# EAGLE design vinciDuino (EAGLE 6.2)
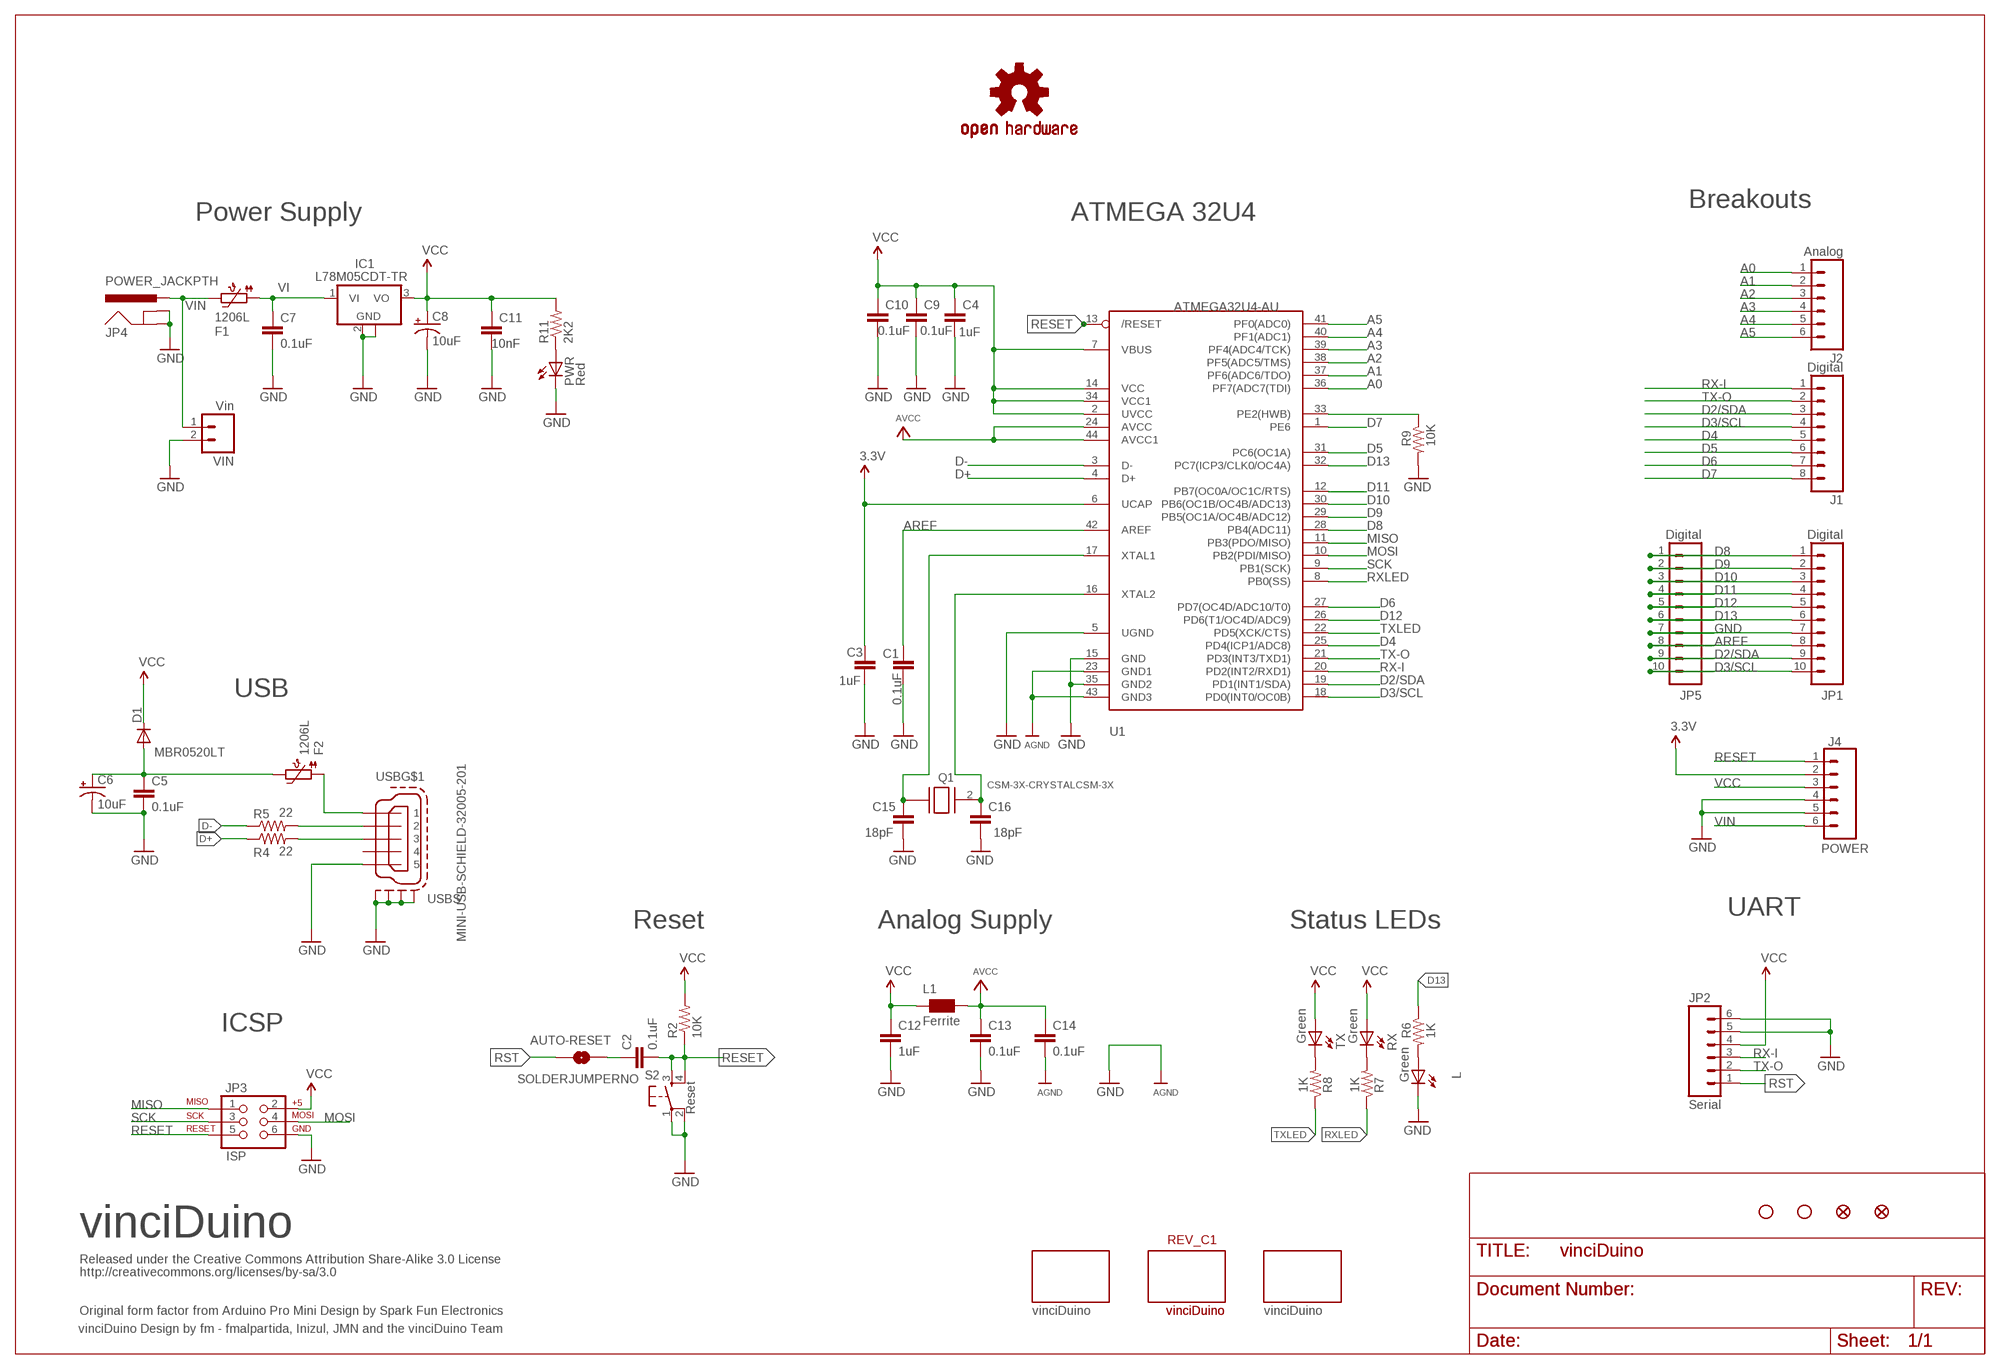
[diagram p0: schematic, sheet 1]

## Parts
AUTO-RESET  SOLDERJUMPERNO  [SJ_2S-NO]
C1  0.1uF  CAP1206  [1206]
C2  0.1uF  CAP1206  [1206]
C3  1uF  CAP1206  [1206]
C4  1uF  CAP1206  [1206]
C5  0.1uF  CAP1206  [1206]
C6  10uF  CAP_POL1206  [EIA3216]
C7  0.1uF  CAP1206  [1206]
C8  10uF  CAP_POL1206  [EIA3216]
C9  0.1uF  CAP1206  [1206]
C10  0.1uF  CAP1206  [1206]
C11  10nF  CAP1206  [1206]
C12  1uF  CAP1206  [1206]
C13  0.1uF  CAP1206  [1206]
C14  0.1uF  CAP1206  [1206]
C15  18pF  CAP1206  [1206]
C16  18pF  CAP1206  [1206]
D1  MBR0520LT  [SOD123]
F1  1206L  PTC1206_L  [1206_PTC]
F2  1206L  PTC1206_L  [1206_PTC]
IC1  L78M05CDT-TR  78XX  [SOT-223-DPAK]
J1  Digital  M081X08  [1X08]
J2  Analog  M06SIP  [1X06]
J4  POWER  M06SIP  [1X06]
JP1  Digital  M10"  [1X10]
JP2  Serial  M06SIP  [1X06]
JP3  ISP  AVR_SPI_PRG_6PTH  [2X3]
JP4  POWER_JACKPTH  [POWER_JACK_PTH]
JP5  Digital  M10"  [1X10]
L  Green  LED1206  [LED-1206]
L1  Ferrite  WE-CBF_1206W  [1206W]
PWR  Red  LED1206  [LED-1206]
Q1  CSM-3X-CRYSTALCSM-3X  [CSM-3X]
R2  10K  R-US_R1206  [R1206]
R4  22  R-US_R1206  [R1206]
R5  22  R-US_R1206  [R1206]
R6  1K  R-US_R1206  [R1206]
R7  1K  R-US_R1206  [R1206]
R8  1K  R-US_R1206  [R1206]
R9  10K  R-US_R1206  [R1206]
R11  2K2  R-US_R1206  [R1206]
REV_C1  vinciDuino  BOARD_INFO_  [ARDUINO_FORUM]
RX  Green  LED1206  [LED-1206]
S2  Reset  TAC_SWITCHSMD  [TACTILE_SWITCH_SMD]
TX  Green  LED1206  [LED-1206]
U1  ATMEGA32U4-AU  [TQFP44]
U$1  VINCIDUINO_  VINCIDUINO_25  [VINCIDUINO]
U$2  FIDUCIAL1X2  [FIDUCIAL-1X2]
U$3  VINCIDUINO_15  [VINCIDUINO_VSMAL]
U$4  FIDUCIAL1X2  [FIDUCIAL-1X2]
U$9  STAND-OFF  [STAND-OFF]
U$10  STAND-OFF  [STAND-OFF]
U$14  OSHW-LOGOS  [OSHW-LOGO-S]
USB  MINI-USB-SCHIELD-32005-201  [32005-201]
VIN  Vin  M021X02_NO_SILK  [1X02_NO_SILK]

## Nets
3.3V: C3.1 J4.2 U1.6(UCAP)
A0: J2.1 U1.36(PF7(ADC7(TDI))
A1: J2.2 U1.37(PF6(ADC6/TDO))
A2: J2.3 U1.38(PF5(ADC5/TMS))
A3: J2.4 U1.39(PF4(ADC4/TCK))
A4: J2.5 U1.40(PF1(ADC1))
A5: J2.6 U1.41(PF0(ADC0))
AREF: C1.2 JP1.8 JP5.8 U1.42(AREF)
AVCC: C13.1 C14.1 L1.2 U1.24(AVCC) U1.44(AVCC1)
D2/SDA: J1.3 JP1.9 JP5.9 U1.19(PD1(INT1/SDA))
D3/SCL: J1.4 JP1.10 JP5.10 U1.18(PD0(INT0/OC0B))
D4: J1.5 U1.25(PD4(ICP1/ADC8))
D5: J1.6 U1.31(PC6(OC1A))
D6: J1.7 U1.27(PD7(OC4D/ADC10/T0))
D7: J1.8 U1.1(PE6)
D8: JP1.1 JP5.1 U1.28(PB4(ADC11))
D9: JP1.2 JP5.2 U1.29(PB5(OC1A/OC4B/ADC12))
D10: JP1.3 JP5.3 U1.30(PB6(OC1B/OC4B/ADC13))
D11: JP1.4 JP5.4 U1.12(PB7(OC0A/OC1C/RTS))
D12: JP1.5 JP5.5 U1.26(PD6(T1/OC4D/ADC9))
D13: JP1.6 JP5.6 R6.1 U1.32(PC7(ICP3/CLK0/OC4A))
D+: R4.1 U1.4(D+)
D-: R5.1 U1.3(D-)
GND: C1.1 C3.2 C4.2 C5.2 C6.C(-) C7.2 C8.C(-) C9.2 C10.2 C11.2 C12.2 C13.2 C14.2 C15.2 C16.2 IC1.2(GND) IC1.4(GND) J4.4 J4.5 JP1.7 JP2.5 JP2.6 JP3.6 JP4.GND JP4.GNDBREAK JP5.7 L.C PWR.C R9.2 S2.1 S2.2 U1.5(UGND) U1.15(GND) U1.23(GND1) U1.35(GND2) U1.43(GND3) USB.5 USB.M1(S:S1) USB.M2(S:S2) USB.M3(S:S3) USB.M4(S:S4) VIN.2 ; supply symbol labelled AGND
MISO: JP3.1 U1.11(PB3(PDO/MISO))
MOSI: JP3.4 U1.10(PB2(PDI/MISO))
N$1: R8.2 TX.C
N$2: R5.2 USB.2
N$3: C16.1 Q1.2 U1.16(XTAL2)
N$4: C15.1 Q1.1 U1.17(XTAL1)
N$5: R4.2 USB.3
N$6: R9.1 U1.33(PE2(HWB))
N$7: L.A R6.2
N$8: AUTO-RESET.2 C2.1
N$9: R7.2 RX.C
N$13: F2.1 USB.1
N$38: PWR.A R11.1
RESET: C2.2 J4.1 JP3.5 R2.1 S2.3 S2.4 U1.13(/RESET)
RST: AUTO-RESET.1 JP2.1
RX-I: J1.1 JP2.3 U1.20(PD2(INT2/RXD1))
RXLED: R7.1 U1.8(PB0(SS))
SCK: JP3.3 U1.9(PB1(SCK))
TX-O: J1.2 JP2.2 U1.21(PD3(INT3/TXD1))
TXLED: R8.1 U1.22(PD5(XCK/CTS))
VBUS: C5.1 C6.A(+) D1.A F2.2
VCC: C4.1 C8.A(+) C9.1 C10.1 C11.1 C12.1 D1.C IC1.3(VO) J4.3 JP2.4 JP3.2 L1.1 R2.2 R11.2 RX.A TX.A U1.2(UVCC) U1.7(VBUS) U1.14(VCC) U1.34(VCC1)
VI [vcc]: C7.1 F1.1 IC1.1(VI)
VIN [vcc]: F1.2 J4.6 JP4.PWR VIN.1
Unconnected: USB.4

## Notes on the sheet
- Breakouts
- Power Supply | ATMEGA 32U4
- USB
- UART
- Reset | Analog Supply | Status LEDs
- ICSP
- vinciDuino
- Released under the Creative Commons Attribution Share-Alike 3.0 License
- http://creativecommons.org/licenses/by-sa/3.0
- Original form factor from Arduino Pro Mini Design by Spark Fun Electronics
- vinciDuino Design by fm - fmalpartida, Inizul, JMN and the vinciDuino Team

## Library data of the parts
AUTO-RESET = SparkFun:SOLDERJUMPER: Solder Jumper Standard SMD solder jumper. Used to automate production. Two varients : Normally Open and Normally Closed are the same, but have different paste layers. NC will have a large amount of paste and should jumper during reflow.
C1-C5 C7 C9-C16 = sparkfun_2:CAP: Capacitor Standard 0603 ceramic capacitor, and 0.1" leaded capacitor.
C6 C8 = SparkFun:CAP_POL: Capacitor Polarized These are standard SMD and PTH capacitors. Normally 10uF, 47uF, and 100uF in electrolytic and tantalum varieties. Always verify the external diameter of the through hole cap, it varies with capacity, voltage, and manufacturer. The EIA devices should be standard.
D1 = diode:MBR0520LT: SCHOTTKY BARRIER RECTIFIER Source: http://onsemi.com .. MBR0520LT1-D.pdf
F1 F2 = microbuilder:PTC: PTC (Resettable Fuse) 1206 Package 250mA PTC (16V Max, Time-to-Trip: 0.08s) - Digikey: F2110CT-ND 1210 Package 100mA PTC (30V Max, Time-to-Trip: 0.6s) - Digikey: MF-USMF010-2CT-ND 1812 Package 750mA PTC (24V Max, Time-to-Trip: 0.2s) - Digikey: MF-MSMF075/24-2CT-ND
IC1 = fmc:78XX
J1 = SparkFun:M08: Header 8 Standard 8-pin 0.1" header. Use with straight break away headers (SKU : PRT-00116), right angle break away headers (PRT-00553), swiss pins (PRT-00743), machine pins (PRT-00117), and female headers (PRT-00115).
J2 J4 JP2 = SparkFun:M06: Header 6 Standard 6-pin 0.1" header. Use with straight break away headers (SKU : PRT-00116), right angle break away headers (PRT-00553), swiss pins (PRT-00743), machine pins (PRT-00117), and female headers (PRT-00115). Molex polarized connector foot print use with SKU : PRT-08094 with associated crimp pins and housings. NOTES ON THE VARIANTS LOCK and LOCK_LONGPADS... This footprint was designed to help hold the alignment of a through-hole component (i.e. 6-pin header) while soldering it into place. You may notice that each hole has been shifted either up or down by 0.005 of an inch from it's more standard position (which is a perfectly straight line). This slight alteration caused the pins (the squares in the middle) to touch the edges of the holes. Because they are alternating, it causes a "brace" to hold the component in place. 0.005 has proven to be the perfect amount of "off-center" position when using our standard breakaway headers. Although looks a little odd when you look at the bare footprint, once you have a header in there, the alteration is very hard to notice. Also, if you push a header all the way into place, it is covered up entirely on the bottom side. This idea of altering the position of holes to aid alignment will be further integrated into the Sparkfun Library for other footprints. It can help hold any component with 3 or more connection pins.
JP1 JP5 = SparkFun:M10: Header 10 Standard 10-pin 0.1" header. Use with straight break away headers (SKU : PRT-00116), right angle break away headers (PRT-00553), swiss pins (PRT-00743), machine pins (PRT-00117), and female headers (PRT-00115).
JP3 = SparkFun:AVR_SPI_PRG_6: AVR ISP 6 Pin This is the reduced ISP connector for AVR programming. Common on Arduino. This footprint will take up less PCB space and can be used with a 10-pin to 6-pin adapter such as SKU: BOB-08508
JP4 = SparkFun:POWER_JACK: Power Jack This is the standard 5.5mm barrel jack for power. The PTH is the most common, proven, reliable, footprint. All others are experimental. The Slot footprint only works if the mill layer is transmitted to the PCB fab house so be warned. Spark Fun Electronics SKU : PRT-00119. Mating wall wart : TOL-00298 (and others)
L PWR RX TX = SparkFun:LED: LEDs Standard schematic elements and footprints for 5mm, 3mm, 1206, and 0603 sized LEDs. 5mm - Spark Fun Electronics SKU : COM-00529 (and others)
L1 = wuerth-elektronik:WE-CBF: SMD EMI Suppression Ferrite Beads - excellent anti-EMI properties - low DCR - impedances till 3000 ohms - rated current up to 6 A
Q1 = fmc:CSM-3X-CRYSTAL
R2 R4-R9 R11 = adafruit:R-US_: RESISTOR, American symbol
REV_C1 = fmc:BOARD_INFO_
S2 = SparkFun:TAC_SWITCH: Momentary Switch Button commonly used for reset or general input. Spark Fun Electronics SKU : COM-00097
U1 = adafruit:ATMEGA32U4: http://www.ladyada.net/library/eagle
U$1 U$3 = fmc:VINCIDUINO_
U$2 U$4 = SparkFun:FIDUCIAL: Fiducial Alignment Points Various fiducial points for machine vision alignment.
U$9 U$10 = SparkFun:STAND-OFF: Stand Off This is the mechanical footprint for a #4 phillips button head screw. Use the keepout ring to avoid running the screw head into surrounding components. SKU : PRT-00447
U$14 = SparkFun:OSHW-LOGO: Open Source Hardware Logo This logo indicates the piece of hardware it is found on incorporates a OSHW license and/or adheres to the definition of open source hardware found here: http://freedomdefined.org/OSHW
USB = con-cypressindustries:MINI-USB-SCHIELD-: MINI USB-B Conector Source: www.cypressindustries.com; OC_FARNELL: unknown; OC_NEWARK: unknown
VIN = SparkFun:M02: Header 2 Standard 2-pin 0.1" header. Use with straight break away headers (SKU : PRT-00116), right angle break away headers (PRT-00553), swiss pins (PRT-00743), machine pins (PRT-00117), and female headers (PRT-00115). Molex polarized connector foot print use with SKU : PRT-08233 with associated crimp pins and housings.

## Net classes
1 vcc: width 0.254 mm

## Board
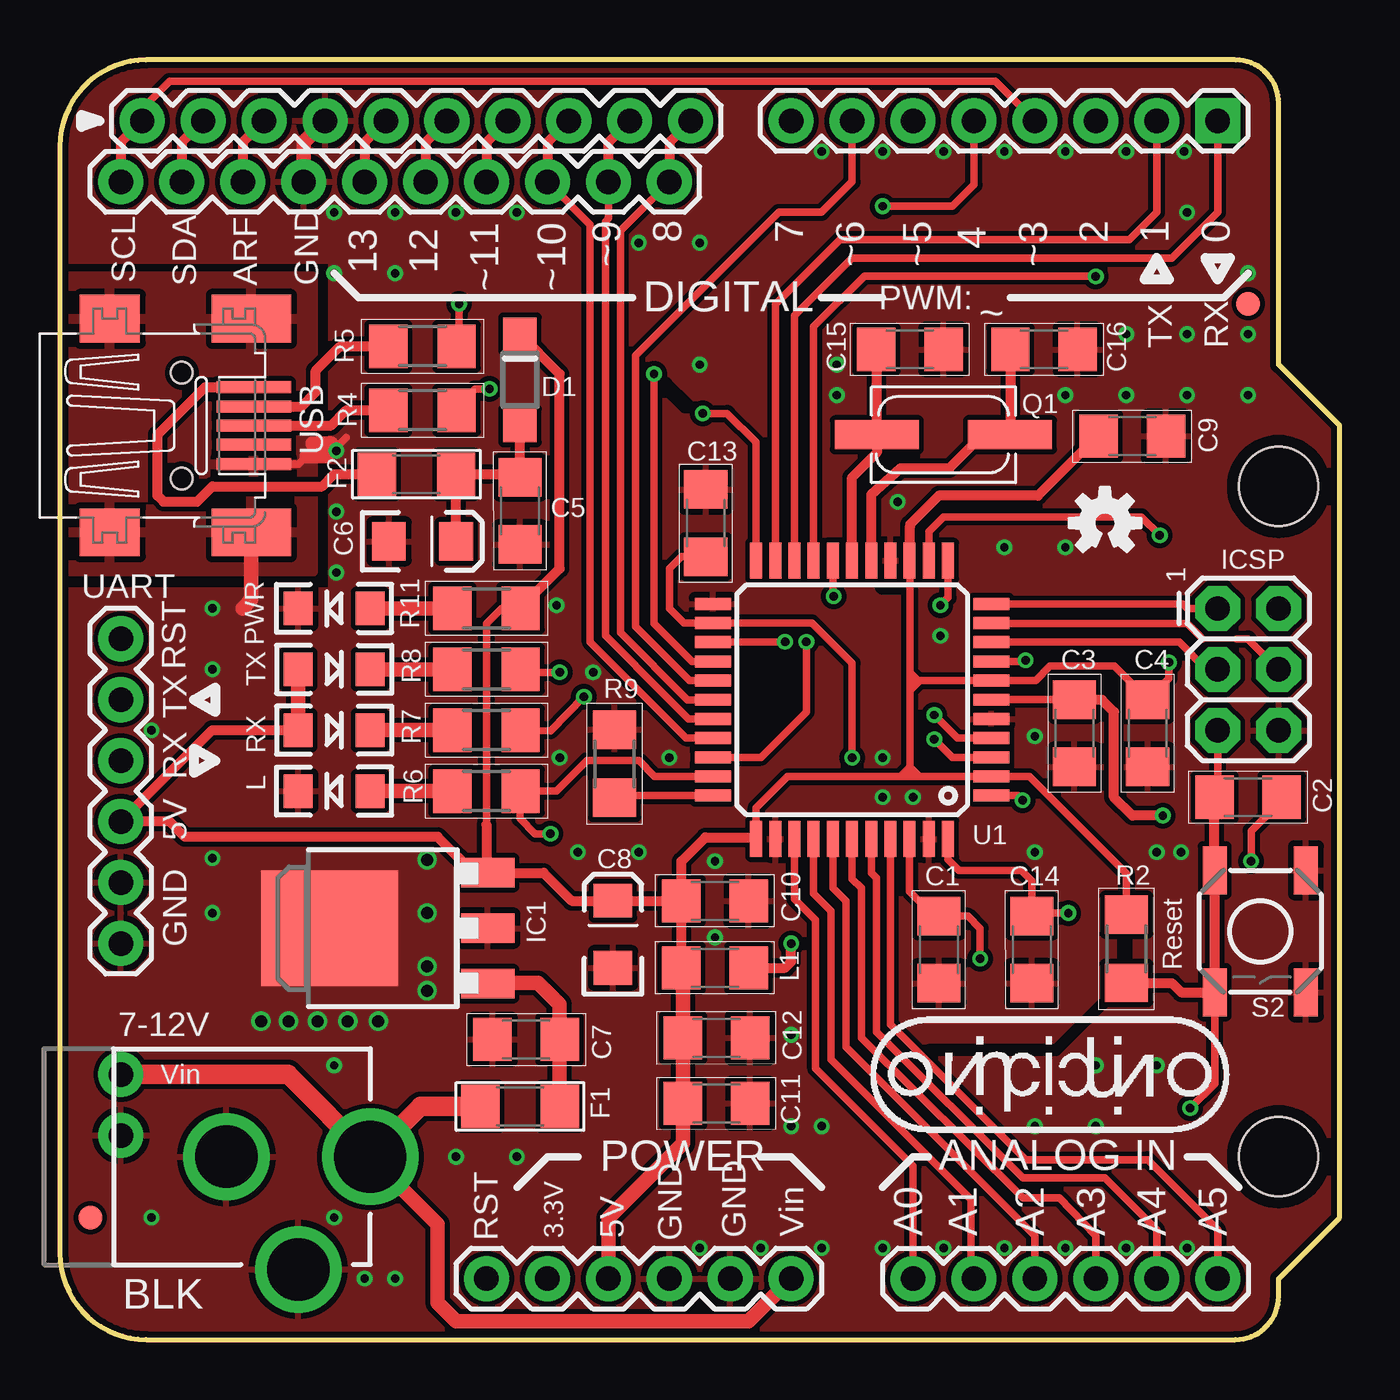
[diagram p1: board, top side]
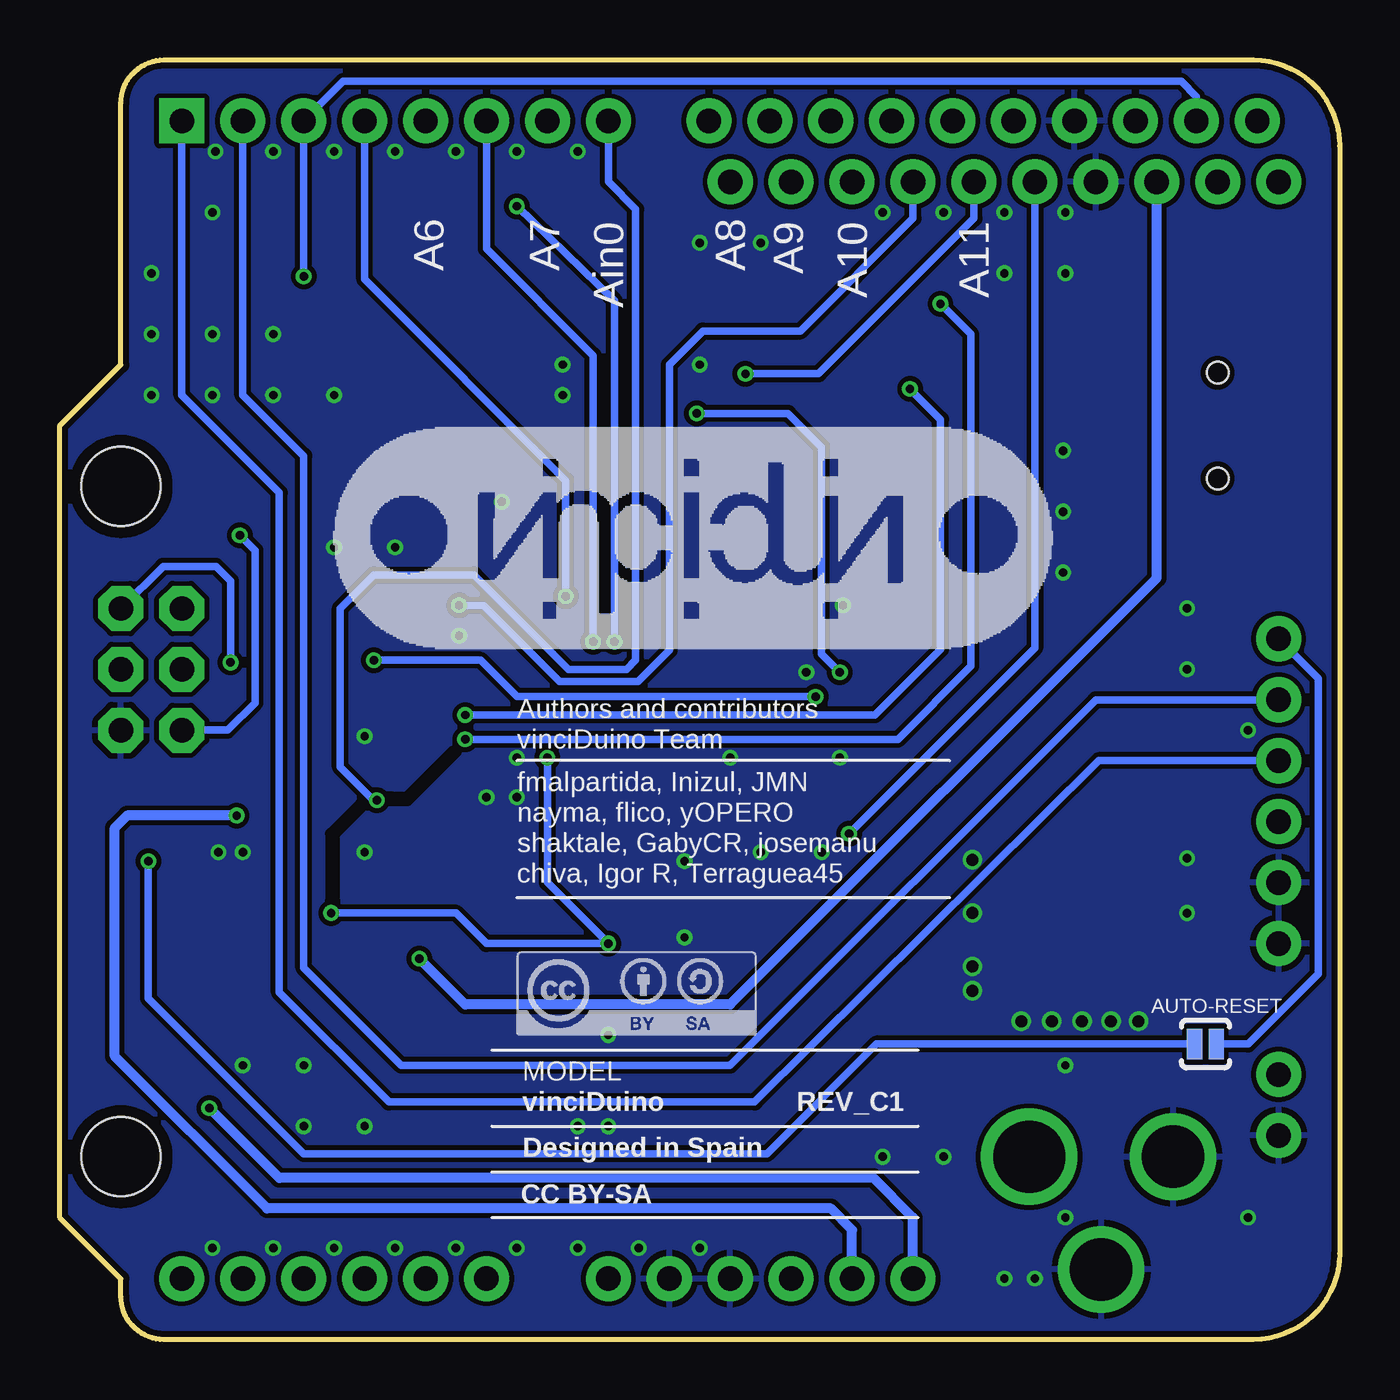
[diagram p2: board, bottom side, seen from below]

Size 53.34 x 53.34 mm. Coordinates in mm from the lower left corner, seen from the top.
Outline: 50.8,40.64 50.8,51.54 arc90 49,53.34 3.59,53.34 arc90 0,49.75 0,3.59 arc90 3.59,0 49,0 arc90 50.8,1.8 50.8,2.54 53.34,5.08 53.34,38.1 50.8,40.64
Copper layers (1*16): Top 0.0356mm / dielectric 1.5011mm / Bottom 0.0356mm
Design rules: minimum track width 6mil, minimum drill 0.35mm, track to track 8mil, track to pad 8mil, pad to pad 8mil, via to via 8mil, smd to smd 8mil, copper to edge 10mil, drill to drill 6mil, minimum pad ring 12mil, minimum via ring 6mil, stop-mask expansion 4mil, vias tented up to drill 25mil, thermal gap 10mil
tRestrict: area 34.3,31.4 to 34.9,31.5; area 25.1,38.9 to 26.2,39.9; area 36.2,12.1 to 43.4,14; area 44.3,15.9 to 44.5,16.8
bRestrict: area 36.8,22.5 to 39.5,24.5; area 40.6,18.3 to 42,22.4

### Footprints (pad centres in the part's own frame; a part is rotated, then mirrored left to right if it is on the bottom)
SJ_2S-NO = smd 0.635 x 1.27: 1 -0.45,0; 2 0.45,0
1206 = smd 1.6 x 1.8: 1 -1.4,0; 2 1.4,0
EIA3216 = smd 1.4 x 1.6: A 1.4,0; C -1.4,0
SOD123 = smd 1.4 x 1.4: A 1.9,0; C -1.9,0
1206_PTC = smd 1.6 x 1.8: 1 -1.654,0; 2 1.654,0
SOT-223-DPAK = smd 1.219 x 2.235: 1 -2.311,-3.099; 2 0,-3.099; 3 2.311,-3.099 | smd 4.826 x 5.715: 4 0,3.493
1X08@1 = drill 1.016 pad 1.88 square: 1 0,0 | drill 1.016 pad 1.88: 2 2.54,0; 3 5.08,0; 4 7.62,0; 5 10.16,0; 6 12.7,0; 7 15.24,0; 8 17.78,0
1X06@1 = drill 1.016 pad 1.88: 1 -6.35,0; 2 -3.81,0; 3 -1.27,0; 4 1.27,0; 5 3.81,0; 6 6.35,0
1X10 = drill 1.016 pad 1.88: 1 0,0; 2 2.54,0; 3 5.08,0; 4 7.62,0; 5 10.16,0; 6 12.7,0; 7 15.24,0; 8 17.78,0; 9 20.32,0; 10 22.86,0
2X3@1 = drill 1.016 pad 1.88 octagon: 1 0,0; 2 0,2.54; 3 2.54,0; 4 2.54,2.54; 5 5.08,0; 6 5.08,2.54
POWER_JACK_PTH@1 = drill 2.6: GND 0,7.7; GNDBREAK 4.7,10.7 | drill 3: PWR 0,13.7
LED-1206 = smd 1.2 x 1.4: A -1.5,0; C 1.5,0
1206W = smd 1.6 x 1.8: 1 -1.4,0; 2 1.4,0
CSM-3X = smd 3.5 x 1.2: 1 2.775,0; 2 -2.775,0
R1206 = smd 1.6 x 1.803: 1 -1.422,0; 2 1.422,0
TACTILE_SWITCH_SMD@1 = smd 2 x 1: 1 -2.54,1.905; 2 2.54,1.905; 3 -2.54,-1.905; 4 2.54,-1.905
TQFP44 = smd 1.5 x 0.5: 1 -5.8,4; 2 -5.8,3.2; 3 -5.8,2.4; 4 -5.8,1.6; 5 -5.8,0.8; 6 -5.8,0; 7 -5.8,-0.8; 8 -5.8,-1.6; 9 -5.8,-2.4; 10 -5.8,-3.2; 11 -5.8,-4; 23 5.8,-4; 24 5.8,-3.2; 25 5.8,-2.4; 26 5.8,-1.6; 27 5.8,-0.8; 28 5.8,0; 29 5.8,0.8; 30 5.8,1.6; 31 5.8,2.4; 32 5.8,3.2; 33 5.8,4 | smd 0.5 x 1.5: 12 -4,-5.8; 13 -3.2,-5.8; 14 -2.4,-5.8; 15 -1.6,-5.8; 16 -0.8,-5.8; 17 0,-5.8; 18 0.8,-5.8; 19 1.6,-5.8; 20 2.4,-5.8; 21 3.2,-5.8; 22 4,-5.8; 34 4,5.8; 35 3.2,5.8; 36 2.4,5.8; 37 1.6,5.8; 38 0.8,5.8; 39 0,5.8; 40 -0.8,5.8; 41 -1.6,5.8; 42 -2.4,5.8; 43 -3.2,5.8; 44 -4,5.8
FIDUCIAL-1X2 = smd 1 x 1: 1 0,0
STAND-OFF@1 = hole 3.302: 0,0
32005-201 = smd 3.1 x 0.5: 1 3,1.6; 2 3,0.8; 3 3,0; 4 3,-0.8; 5 3,-1.6 | smd 2.5 x 2: M1 -3,-4.45; M2 -3,4.45 | smd 3.3 x 2: M3 2.9,4.45; M4 2.9,-4.45 | hole 0.9: 0,2.2; 0,-2.2
1X02_NO_SILK = drill 1.016 pad 1.88: 1 0,0; 2 2.54,0

### Placement (x,y rotation side)
AUTO-RESET  5.59,12.32 180 bottom
C1  36.64,16.26 90 top
C2  49.53,22.61 180 top
C3  42.29,25.27 270 top
C4  45.34,25.27 270 top
C5  19.18,34.54 270 top
C6  15.11,33.27 0 top
C7  19.43,12.51 180 top
C8  23.05,16.89 90 top
C9  44.7,37.66 0 top
C10  27.3,18.29 0 top
C11  27.37,9.84 0 top
C12  27.37,12.57 0 top
C13  26.92,34.04 90 top
C14  40.51,16.26 270 top
C15  35.43,41.27 0 top
C16  41.02,41.27 0 top
D1  19.18,40.01 270 top
F1  19.18,9.72 180 top
F2  14.86,36.07 0 top
IC1  14.73,17.14 90 top
J1  Digital  [1X08@1]  48.26,50.8 180 top
J2  Analog  [1X06@1]  41.91,2.54 0 top
J4  POWER  [1X06@1]  24.13,2.54 0 top
JP1  26.29,50.8 180 top
JP2  Serial  [1X06@1]  2.54,22.86 270 top
JP3  ISP  [2X3@1]  48.26,30.47 270 top
JP4  POWER_JACKPTH  [POWER_JACK_PTH@1]  -0.76,7.62 270 top
JP5  25.4,48.26 180 top
L  11.43,22.86 180 top
L1  27.3,15.49 0 top
PWR  11.43,30.48 180 top
Q1  36.83,37.72 180 top
R2  44.45,16.29 90 top
R4  15.11,38.73 180 top
R5  15.11,41.4 180 top
R6  17.78,22.86 180 top
R7  17.78,25.4 180 top
R8  17.78,27.94 180 top
R9  23.11,24 90 top
R11  17.78,30.48 0 top
REV_C1  26.67,8.89 0 bottom
RX  11.43,25.4 0 top
S2  Reset  [TACTILE_SWITCH_SMD@1]  50.04,17.02 270 top
TX  11.43,27.94 0 top
U1  33.02,26.67 180 top
U$1  41.91,28.83 0 bottom
U$2  1.27,5.08 0 top
U$3  33.78,8.64 0 top
U$4  49.53,43.18 0 top
U$9  STAND-OFF  [STAND-OFF@1]  50.8,35.56 0 top
U$10  STAND-OFF  [STAND-OFF@1]  50.8,7.62 0 top
U$13  [SA-BY]  34.29,12.7 0 bottom
U$14  43.56,34.04 0 top
USB  5.08,38.1 0 top
VIN  2.54,11.05 270 top

### Tracks (layer width: path | path; a pad name or v marks a point on that pad's centre or on a via)
3.3V  (via drill 0.35)
  Top 0.305: C3.1 U1.6
  Top 0.406: v45.97,21.84 44.7,21.84 43.94,22.61 43.94,26.16 43.43,26.67 C3.1
  Bottom 0.406: J4.2 20.32,4.57 21.21,5.46 44.7,5.46 51.05,11.81 51.05,21.34 50.55,21.84 v45.97,21.84
A0
  Top 0.305: U1.36 30.62,18.37 31.5,17.49 31.5,11.3 35.56,7.24 J2.1
A1
  Top 0.305: U1.37 31.42,18.59 32.13,17.88 32.13,11.68 37.97,5.84 37.97,2.67 J2.2
A2
  Top 0.305: U1.38 32.22,18.83 32.77,18.29 32.77,12.19 40.64,4.32 J2.3
A3
  Top 0.305: U1.39 33.02,19.21 33.4,18.83 33.4,12.57 40.13,5.91 41.66,5.91 43.18,4.32 J2.4
A4
  Top 0.305: 33.78,20.83 U1.40 33.82,19.46 34.04,19.24 34.04,12.83 40.13,6.73 43.56,6.73 45.72,4.57 J2.5
A5
  Top 0.305: U1.41 34.62,13.13 40.26,7.49 45.34,7.49 48.26,4.57 J2.6
AREF  (via drill 0.35)
  Top 0.305: U1.42 35.42,18.68 36.58,17.53 36.64,17.53 C1.2 37.85,17.65 38.35,17.14 v38.35,15.88
  Top 0.406: JP1.8 7.62,49.91 JP5.8
  Bottom 0.406: v38.35,15.88 36.45,13.97 25.4,13.97 7.62,31.75 JP5.8
AVCC  (via drill 0.35)
  Top 0.305: U1.44 37.02,20 37.47,19.56 40.07,19.56 40.51,19.11 C14.1 40.51,17.78 v42.04,17.78 | C13.1 25.91,32.64 25.4,32.13 25.4,30.48 26.01,29.87 U1.24 31.34,29.87 33.02,28.19 v33.02,24.26
  Top 0.406: v30.48,16.51 30.48,15.75 30.23,15.49 L1.2
  Bottom 0.305: v30.48,16.51 33.02,19.05 v33.02,24.26 | v30.48,16.51 31.75,17.78 | v42.04,17.78 36.83,17.78 35.56,16.51 v30.48,16.51
D2/SDA  (via drill 0.35)
  Top 0.305: U1.19 31.42,42.22 33.53,44.32 v43.18,44.32
  Top 0.406: JP1.9 5.08,49.91 JP5.9
  Bottom 0.305: JP1.9 5.97,51.82 6.6,52.45 41.53,52.45 J1.3 v43.18,44.32
D3/SCL  (via drill 0.35)
  Top 0.305: JP1.10 3.43,51.31 4.57,52.45 38.99,52.45 J1.4 | U1.18 32.22,31.03 v32.26,30.99
  Top 0.406: JP1.10 2.54,49.91 JP5.10
  Bottom 0.305: v32.26,30.99 32.26,35.81 40.64,44.2 J1.4
D4  (via drill 0.35)
  Top 0.305: U1.25 29.6,29.07 v30.23,29.08 | v34.29,47.24 37.21,47.24 38.1,48.13 J1.5
  Bottom 0.305: v30.23,29.08 30.23,43.31 v34.29,47.24
D5  (via drill 0.35)
  Top 0.305: U1.31 29.22,24.27 31.11,26.16 v31.11,29.08
  Bottom 0.305: v31.11,29.08 31.11,41.02 35.56,45.47 J1.6
D6
  Top 0.305: 26.5,27.47 U1.27 26.25,27.47 24,29.72 24,41.02 29.97,46.99 31.75,46.99 33.02,48.26 J1.7
D7  (via drill 0.35)
  Top 0.305: U1.1 39.94,22.67 v40.13,22.48
  Bottom 0.305: v40.13,22.48 40.26,22.48 41.66,23.88 41.66,30.48 40.26,31.88 36.07,31.88 32.13,27.94 29.72,27.94 29.34,28.32 29.34,47.12 30.48,48.26 J1.8
D8
  Top 0.305: U1.28 26.16,26.67 23.37,29.46 23.37,46.23 JP5.1
  Top 0.406: JP1.1 25.4,49.91 JP5.1
D9
  Top 0.305: 25.27,26.8 22.73,29.34 22.73,46.61 22.86,46.74 JP5.2 | 25.27,26.8 | 25.27,26.8 26.19,25.88 U1.29
  Top 0.406: JP5.2 22.86,49.91 JP1.2
D10
  Top 0.305: U1.30 27.21,25.08 26.1,25.08 22.1,29.08 22.1,46.48 JP5.3
  Top 0.406: JP1.3 20.32,49.91 JP5.3
D11  (via drill 0.35)
  Top 0.305: U1.12 37.02,30.92 v36.7,30.61
  Top 0.406: JP1.4 17.78,49.91 JP5.4
  Bottom 0.305: v36.7,30.61 35.69,30.61 32.51,27.43 29.24,27.43 27.94,28.73 27.94,40.64 26.54,42.04 22.48,42.04 17.78,46.74 JP5.4
D12  (via drill 0.35)
  Top 0.305: U1.26 26.34,28.27 24.77,29.84 v24.77,40.26
  Top 0.406: JP1.5 15.24,49.91 JP5.5
  Bottom 0.305: v24.77,40.26 21.72,40.26 15.24,46.74 JP5.5
D13  (via drill 0.35)
  Top 0.305: U1.32 24.79,23.47 24.13,24.13 21.97,24.13 20.7,22.86 R6.1 19.18,22.84 19.18,21.72 19.81,21.08 v20.45,21.08
  Top 0.406: JP1.6 12.7,49.91 JP5.6
  Bottom 0.305: v20.45,21.08 12.7,28.83 JP5.6
D+  (via drill 0.35)
  Top 0.305: U1.4 37.41,25.07 v36.45,26.04 | 16.51,38.71 R4.1 17.3,39.62 v17.91,39.62
  Bottom 0.305: v36.45,26.04 19.37,26.04 16.64,28.77 16.64,38.35 v17.91,39.62
D-  (via drill 0.35)
  Top 0.305: U1.3 37.2,24.27 v36.45,25.02 | v16.64,43.18 16.64,41.5 R5.1
  Bottom 0.305: v36.45,25.02 18.41,25.02 15.37,28.07 15.37,41.91 v16.64,43.18
GND  (via drill 0.35, 0.5)
  Top 0.305: USB.5 9.96,36.5 10.29,36.83 | 11.18,36.83 11.94,37.59
  Top 0.61: 10.92,50.67 10.16,49.91 JP5.7 | 10.29,36.83 11.18,36.83 | USB.M4 7.98,30.84 7.62,30.48 | 10.54,37.34 11.3,37.34
  other vias: 22.23,27.81 24.13,20.32 21.59,20.32 24.13,45.72 39.37,49.53 26.67,45.72 11.43,44.45 11.43,46.99 40.64,8.89 43.18,8.89 46.99,39.37 49.53,39.37 34.29,49.53 46.99,46.99 30.48,12.7 39.37,33.02 41.91,33.02 41.91,49.53 49.53,44.45 13.97,46.99 13.97,44.45 11.53,31.97 26.67,3.81 29.21,3.81 3.81,5.08 46.99,41.91 49.53,41.91 6.35,20.07 6.35,17.78 26.67,40.64 10.73,13.27 12,13.27 13.27,13.27 15.3,14.54 15.3,15.56 15.3,17.78 8.38,13.27 9.53,13.27 15.3,20 45.72,20.32 46.74,20.32 40.64,25.15 16.51,7.62 19.05,7.62 11.43,11.43 34.29,24.26 36.7,29.34 43.18,11.43 45.72,11.43 34.29,22.61 35.56,22.61 36.83,3.81 39.37,3.81 41.91,3.81 44.45,3.81 46.99,3.81 27.3,19.94 27.3,16.76 31.75,8.89 30.48,8.89 40.64,20.32 11.43,5.08 12.7,2.54 13.97,2.54 20.7,30.61 6.35,30.48 6.35,27.94 11.53,34.51 44.45,49.53 36.83,49.53 46.86,49.53 31.75,49.53 16.51,46.99 19.05,46.99 31.75,3.81 34.29,3.81 25.4,24.26 20.83,24.26 3.81,25.4 44.45,41.91 44.45,39.37 32.38,39.37 34.92,34.92 32.38,40.64 41.91,39.37 11.53,37.05
  pour Top (isolate 0.203): 0,53.34 53.34,53.34 53.34,0 0,0 0,31.24 11.3,31.24 11.3,44.96 0,44.96
  pour Bottom (isolate 0.203): 0,53.34 53.34,53.34 53.34,0 15.88,0.13 10.79,0.13 0,0
  pour Top (no thermals): 7.62,20.32 15.24,20.32 15.24,13.97 7.62,13.97
  pour Top: 0,44.32 10.54,44.32 10.54,32 0,32
MISO
  Top 0.305: U1.11 46.8,30.67 46.99,30.48 JP3.1
MOSI
  Top 0.203: 47.62,29.21 49.05,29.21
  Top 0.305: U1.10 38.84,29.84 46.99,29.84 47.5,29.34 47.62,29.21 | 49.05,29.21 49.52,29.21 JP3.4
N$1
  Top 0.61: TX.C R8.2
N$2
  Top 0.305: 13.97,41.91 13.72,41.66 13.72,41.4 R5.2
  Top 0.406: USB.2 10.07,38.9 10.67,39.5 10.67,40.39 11.68,41.4 R5.2
N$3
  Top 0.406: C16.1 39.62,37.73 Q1.2 38.48,37.72 37.08,36.32 35.05,36.32 33.82,35.22 U1.16
N$4
  Top 0.406: C15.1 34.03,37.72 34.04,37.72 Q1.1 34.05,36.98 33.02,35.94 U1.17
N$5
  Top 0.406: USB.3 11.3,38.1 11.94,38.73 R4.2
N$6
  Top 0.305: U1.33 23.2,22.67 R9.1
N$7
  Top 0.61: L.A R6.2
N$8  (via drill 0.35)
  Top 0.305: C2.1 50.93,22.48 49.66,21.21 v49.66,19.94
  Bottom 0.305: AUTO-RESET.2 19.3,12.32 23.88,7.75 43.18,7.75 49.66,14.22 v49.66,19.94
N$9
  Top 0.61: RX.C R7.2
N$13
  Top 0.406: USB.1 6.04,39.7 4.06,37.72 4.06,35.18 4.32,34.92 5.71,34.92 6.35,35.56 10.92,35.56 11.43,36.07 F2.1
N$38
  Top 0.61: PWR.A R11.1
RESET  (via drill 0.35)
  Top 0.305: U1.13 36.22,33.68 36.83,34.29 45.09,34.29 v45.85,33.53 | JP3.5 48.26,22.74 C2.2 | S2.3 | 48.13,13.97 48.13,10.67 v47.12,9.65 | S2.4 48.01,14.48
  Top 0.406: S2.4 S2.3 | S2.3 C2.2 | R2.1 46.35,14.87 46.74,14.48 48.01,14.48 48.01,14.22 | 48.01,14.22 48.26,13.97 | 48.01,14.22 48.01,14.1 48.13,13.97
  Bottom 0.305: v45.85,33.53 45.21,32.89 45.21,26.54 46.35,25.4 JP3.5
  Bottom 0.406: J4.1 17.78,5.08 19.43,6.73 44.2,6.73 v47.12,9.65
RST
  Bottom 0.305: JP2.1 0.89,27.56 0.89,15.24 3.81,12.32 AUTO-RESET.1 5.21,12.32
RX-I
  Top 0.305: U1.20 30.62,42.69 33.02,45.09 46.35,45.09 48.26,46.99 J1.1
  Bottom 0.305: JP2.3 10.03,24.13 24.38,9.91 39.62,9.91 44.2,14.48 44.2,35.31 48.26,39.37 J1.1
RXLED  (via drill 0.35)
  Top 0.305: U1.8 40.34,28.27 v40.26,28.32 | v21.84,26.8 20.45,25.38 R7.1
  Bottom 0.305: v40.26,28.32 35.81,28.32 34.29,26.8 v21.84,26.8
SCK
  Top 0.305: U1.9 46.65,29.07 47.78,27.94 JP3.3
TX-O
  Top 0.305: U1.21 29.82,43.16 32.51,45.85 44.58,45.85 45.72,46.99 J1.2
  Bottom 0.305: JP2.2 10.16,26.67 25.4,11.43 39.12,11.43 43.18,15.49 43.18,36.83 45.72,39.37 J1.2
TXLED  (via drill 0.35)
  Top 0.305: R8.1 19.33,27.81 v20.83,27.81 | v26.8,38.61 27.81,38.61 29.02,37.4 U1.22
  Bottom 0.305: v26.8,38.61 22.99,38.61 21.59,37.21 21.59,28.57 v20.83,27.81
VBUS
  Top 0.406: D1.A C5.1 19.05,36.07 F2.2 C6.A
VCC  (via drill 0.35)
  Top 0.254: 35.43,33.91 35.43,33.98
  Top 0.305: 35.56,23.47 30.33,23.47 29.02,22.16 U1.34 28.96,20.93 | 35.56,23.47 U1.2 40.41,23.47 44.45,19.43 R2.2 | 35.43,23.88 35.43,23.6 35.56,23.47 | 35.43,23.88 35.43,27.05 | 35.43,27.05 35.43,27.3 | 35.43,27.3 35.43,27.81 | 35.43,27.81 35.43,32.46 U1.14 35.43,32.48 | 35.43,27.3 35.6,27.47 U1.7 40.68,27.47 41.27,28.07 43.95,28.07 C4.1 46.23,27.56 v46.23,28.23 | 35.43,27.81 35.81,27.43 35.43,27.05 | 35.43,23.88 35.81,23.5 | 35.43,23.88 35.05,23.5 | R11.2 18.41,30.48 17.78,29.84 17.78,21.46
  Top 0.406: R11.2 19.2,30.5 20.83,32.13 20.83,40.25 D1.C | 28.96,20.93 26.9,20.93 25.91,19.94 C10.1 | C10.1 C8.A 21.34,18.29 20.17,19.46 IC1.3 | C10.1 25.91,15.29 L1.1 | 35.43,32.48 35.43,33.91 | RX.A 6.35,25.4 JP2.4 4.57,21.59 5.21,20.95 15.75,20.95 17.4,19.3 17.02,19.3 17.14,19.43 17.09,19.43 IC1.3 | 17.78,19.43 17.07,19.43 IC1.3 | 17.78,21.46 17.78,19.41 IC1.3 | C9.1 42.61,37.02 40.77,35.18 36.64,35.18 35.43,33.98
  Top 0.61: L1.1 25.86,15.34 25.75,15.34 25.53,15.11 | RX.A TX.A | J4.3 22.86,5.08 25.97,8.19 C11.1 C12.1 25.97,14.67 25.53,15.11 | 25.53,15.11 25.4,15.24
  Bottom 0.305: v46.23,28.23 46.23,31.62 46.83,32.23 49.05,32.23 JP3.2
VI
  Top 0.61: IC1.1 17.09,14.86 19.94,14.86 20.83,13.97 C7.1 20.83,10.16 20.95,10.03 20.95,9.97 F1.1
VIN
  Top 0.61: J4.6 28.7,0.76 16.51,0.76 15.75,1.52 15.75,4.81 JP4.PWR
  Top 0.813: F1.2 15.03,9.72 JP4.PWR 9.51,11.05 VIN.1

### Text on the board
tPlace: 8 | 7 | 2 | 1 | 0 | ~9 | ~6 | ~5 | 4 | ~3 | SCL | SDA | ARF | GND | 13 | 12 | ~11 | ~10 | PWM: | DIGITAL | ~ | TX | RX | UART | 1 | ICSP | RST | TX | RX | 5V | GND | Reset | 7-12V | Vin | POWER | ANALOG IN | RST | 3.3V | 5V | GND | GND | Vin | A0 | A1 | A2 | A3 | A4 | A5 | BLK
bPlace: Authors and contributors | vinciDuino Team | fmalpartida, Inizul, JMN | nayma, flico, yOPERO | shaktale, GabyCR, josemanu | chiva, Igor R, Terraguea45
bNames: A11 | A10 | A9 | A8 | Ain0 | A7 | A6
tDocu: Released under the Creative Commons Attribution Share-Alike 3.0 License | http://creativecommons.org/licenses/by-sa/3.0 | vinciDuino